# Altium schematic sheet YTN1-POWER1-RoHS.schdoc
size B; SheetNumber: 0; SheetTotal: 0
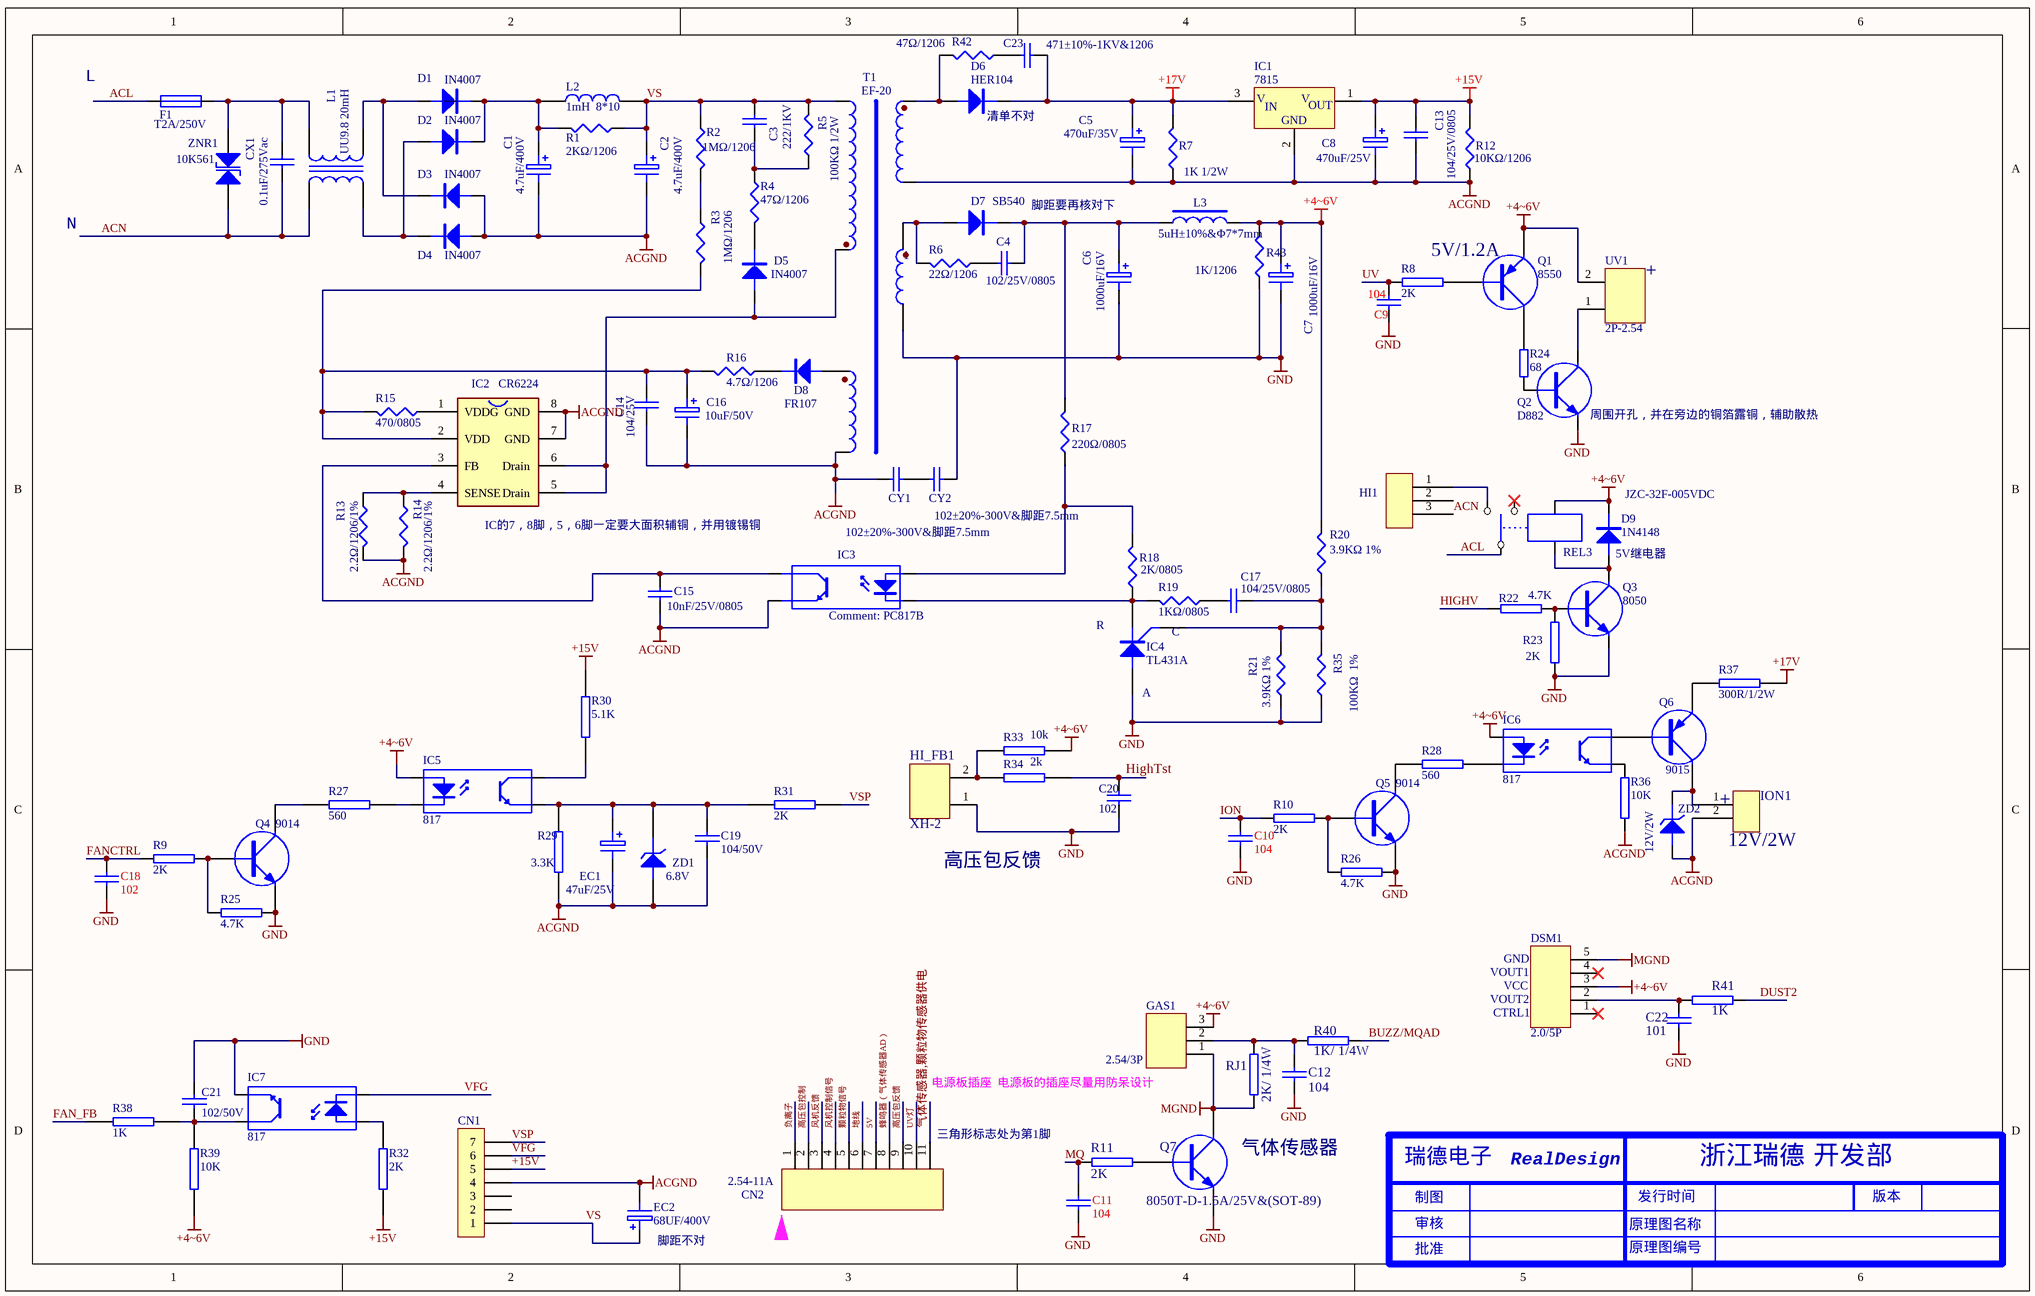
[diagram p0: YTN1-POWER1-RoHS.schdoc]

## Parts
1  (no value)
C1  4.7uF/400V
C2  4.7uF/400V
C3  222/1KV
C4  102/25V/0805
C5  470uF/35V  [ESR]
C6  1000uF/16V  [ESR]
C7  1000uF/16V  [ESR]
C8  470uF/25V  [ESR]
C9  104  [C104]
C10  104  [C104]
C11  104  [C104]
C12  104  [0805C]
C13  104/25V/0805
C14  104/25V
C15  10nF/25V/0805
C16  10uF/50V
C17  104/25V/0805
C18  102  [C104]
C19  104/50V  [0805C]
C20  102  [0805C]
C21  102/50V  [0805C]
C22  101  [0805C]
C23  471±10%-1KV&1206
CN1  (no value)  [XH-7AW]
CN2  2.54-11A  [xh-12aw]
CX1  0.1uF/275Vac
CY1  102±20%-300V&脚距7.5mm  [Y-222]
CY2  102±20%-300V&脚距7.5mm  [Y-222]
D1  IN4007
D2  IN4007
D3  IN4007
D4  IN4007
D5  IN4007
D6  HER104
D7  SB540
D8  FR107
D9  1N4148  [D10s-ai]
DSM1  2.0/5P  [xh-5aw]
EC1  47uF/25V  [47uf25v-ai]
EC2  68UF/400V  [68UF]
F1  T2A/250V
GAS1  2.54/3P  [xh-3aw]
HI1  VH  [xh-3aw]  (value not drawn)
HI_FB1  XH-2  [xh-2aw]
IC1  7815  [7805]
IC2  CR6224
IC3  PC817B
IC4  TL431A  [sip-3p]
IC5  817  [pc817]
IC6  817  [PC817]
IC7  817  [PC817]
ION1  (no value)  [xh-2a]
L1  UU9.8 20mH
L2  1mH  8*10
L3  5uH±10%&Φ7*7mm  [L6]
Q1  8550  [sot-23]
Q2  D882  [13003]
Q3  8050  [sot-23-s-1]
Q4  9014  [SOT-23-S]
Q5  9014  [SOT-23-S]
Q6  9015  [SOT-23-S]
Q7  8050T-D-1.5A/25V&(SOT-89)  [SOT-23-S]
R1  2KΩ/1206
R2  1MΩ/1206
R3  1MΩ/1206
R4  47Ω/1206
R5  100KΩ 1/2W
R6  22Ω/1206
R7  1K 1/2W
R8  2K  [R400]
R9  2K  [0805R-S]
R10  2K  [0805R-S]
R11  2K  [0805R-S]
R12  10KΩ/1206
R13  2.2Ω/1206/1%
R14  2.2Ω/1206/1%
R15  470/0805
R16  4.7Ω/1206
R17  220Ω/0805
R18  2K/0805
R19  1KΩ/0805
R20  3.9KΩ 1%
R21  3.9KΩ 1%
R22  4.7K  [0805r]
R23  2K  [0805r]
R24  68  [0805r-s]
R25  4.7K  [0805R-S]
R26  4.7K  [0805R-S]
R27  560  [0805R]
R28  560  [0805R]
R29  3.3K  [0805R]
R30  5.1K  [0805R]
R31  2K  [0805R]
R32  2K  [0805R]
R33  10k  [0805R]
R34  2k  [0805R]
R35  100KΩ  1%
R36  10K  [R400]
R37  300R/1/2W  [0805R]
R38  1K  [0805R]
R39  10K  [0805R]
R40  1K/ 1/4W  [0805R-S]
R41  1K  [0805R-S]
R42  47Ω/1206
R43  1K/1206
REL3  JZC-32F-005VDC  [HJR-3FF-S-Z]
RJ1  2K/ 1/4W  [0805R-S]
T1  EF-20
UV1  2P-2.54  [xh-2aw]
ZD1  6.8V  [zd400]
ZD2  12V/2W  [ZD400]
ZNR1  10K561  [y]

## Nets
+4~6V: C7.1 D9.K DSM1.3 GAS1.3 IC5.A IC6.A L3.2 Q1.E R20.2 R33.2 R39.1 R43.2 REL3.5 UV1.2
+15V: C8.1 C13.2 CN1.5 IC1.1(VOUT) R12.2 R30.2 R32.1
+17V: C5.1 C23.1 D6.K IC1.3(VIN) R7.2 R37.2
ACGND: C1.2 C2.2 C5.2 C8.2 C13.1 C14.2 C15.2 C16.2 C19.2 CN1.4 CY1.1 D3.A D4.A EC1.2 EC2.2 IC1.2(GND) IC2.7(GND) IC2.8(GND) IC3.E ION1.2 R7.1 R12.1 R13.2 R14.2 R29.1 R36.2 T1.5 T1.7 ZD1.A ZD2.A
GND: 1.1 C6.2 C7.2 C9.2 C10.2 C11.2 C12.2 C18.2 C20.2 C21.1 C22.2 CY2.2 HI_FB1.1 IC4.1 IC7.E Q2.E Q3.E Q4.E Q5.E Q7.E R21.1 R23.1 R25.1 R26.1 R35.1 R43.1
MGND: DSM1.5 GAS1.1 Q7.C RJ1.2
5V: CN2.7
ACL: F1.1 REL3.3
ACN: CX1.1 HI1.3 L1.1 ZNR1.2(K)
BUZZ/MQAD: R40.2
DUST2: R41.2
FAN_FB: R38.2
FANCTRL: C18.1 R9.2
HighTst: C20.1 R34.1
HIGHV: R22.2
ION: C10.1 R10.2
MQ: C11.1 R11.1
UV: C9.1 R8.2
UV灯: CN2.10
VFG: CN1.6 IC7.K
VS: C2.1 C3.2 CN1.1 EC2.1 L2.2 R1.1 R2.1 R5.2 T1.2
VSP: CN1.7 R31.1
地线: CN2.6
气体传感器,颗粒物传感器供电: CN2.11
蜂鸣器（气体传感器AD）: CN2.8
负离子: CN2.1
颗粒物信号: CN2.5
风机反馈: CN2.3
风机控制信号: CN2.4
高压包反馈: CN2.9
高压包控制: CN2.2
Net1_2: 1.2 D7.A R6.2
NetC1_1: C1.1 D1.K D2.K L2.1 R1.2
NetC3_1: C3.1 R4.1 R5.1
NetC4_1: C4.1 C6.1 D7.K L3.1 R17.2
NetC4_2: C4.2 R6.1
NetC12_1: C12.1 GAS1.2 R40.1 RJ1.1
NetC14_1: C14.1 C16.1 IC2.2(VDD) R3.2 R15.2 R16.2
NetC15_1: C15.1 IC2.3(FB) IC3.C
NetC17_1: C17.1 R19.1
NetC17_2: C17.2 IC4.3 R20.1 R21.2 R35.2
NetC19_1: C19.1 EC1.1 IC5.E R29.2 R31.2 ZD1.K
NetC21_2: C21.2 IC7.C R38.1 R39.2
NetC22_1: C22.1 DSM1.2 R41.1
NetC23_2: C23.2 R42.1
NetCX1_2: CX1.2 F1.2 L1.2 ZNR1.1(A)
NetCY1_2: CY1.2 CY2.1
NetD1_A: D1.A D3.K L1.4
NetD2_A: D2.A D4.K L1.3
NetD5_A: D5.A IC2.5(Drain) IC2.6(Drain) T1.3
NetD5_K: D5.K R4.2
NetD6_A: D6.A R42.2 T1.6
NetD8_A: D8.A T1.4
NetD8_K: D8.K R16.1
NetD9_A: D9.A Q3.C REL3.2
NetHI1_1: HI1.1 REL3.4
NetHI_FB1_2: HI_FB1.2 R33.1 R34.2
NetIC2_1: IC2.1(VDDG) R15.1
NetIC2_4: IC2.4(SENSE) R13.1 R14.1
NetIC3_A: IC3.A R17.1 R18.2
NetIC3_K: IC3.K IC4.2 R18.1 R19.2
NetIC5_C: IC5.C R30.1
NetIC5_K: IC5.K R27.1
NetIC6_C: IC6.C Q6.B
NetIC6_E: IC6.E R36.1
NetIC6_K: IC6.K R28.1
NetIC7_A: IC7.A R32.2
NetION1_1: ION1.1 Q6.C ZD2.K
NetQ1_B: Q1.B R8.1
NetQ1_C: Q1.C R24.1
NetQ2_B: Q2.B R24.2
NetQ2_C: Q2.C UV1.1
NetQ3_B: Q3.B R22.1 R23.2
NetQ4_B: Q4.B R9.1 R25.2
NetQ4_C: Q4.C R27.2
NetQ5_B: Q5.B R10.1 R26.2
NetQ5_C: Q5.C R28.2
NetQ6_E: Q6.E R37.1
NetQ7_B: Q7.B R11.2
NetR2_2: R2.2 R3.1

Not connected (* = marked no-connect by the designer): CN1 2 3; DSM1 1* 4*; HI1 2; REL3 1*

## Notes on the sheet
- L
- (near D6) 清单不对
- N
- 脚距要再核对下
- (near Q1) 5V/1.2A
- (near UV1) +
- (near Q2) 周围开孔，并在旁边的铜箔露铜，辅助散热
- (near IC2) IC的7，8脚，5，6脚一定要大面积辅铜，并用镀锡铜
- (near D9) 5V继电器
- R
- (near IC4) C
- (near IC4) A
- (near ION1) +
- (near HI_FB1) 高压包反馈
- (near ION1) 12V/2W
- (near DSM1) VOUT1
- (near DSM1) GND
- (near DSM1) VOUT2
- (near DSM1) CTRL1
- (near DSM1) VCC
- 电源板插座  电源板的插座尽量用防呆设计
- (near CN2) 三角形标志处为第1脚
- 气体传感器
- (near EC2) 脚距不对
- 瑞德电子
- RealDesign
- 浙江瑞德 开发部
- 制图
- 审核
- 原理图名称
- 发行时间
- 版本
- 批准
- 原理图编号
- (in symbol 78L05) V; IN; OUT

## Library data of the parts
1 L2 = INDUCTOR
C1 C2 = Pro18.tmp_150uF/400V_45
C3 C14 C15 C17 CX1 = Pro18.tmp_103M/50V_42
C4 C13 C23 = Pro18.tmp_104M/50V_1
C5-C8 = Pro18.tmp_1KuF/16V_17
C9-C12 C18 C22 = CAP: 瓷片电容、独石电容
C16 = Pro18.tmp_100uF/35V_31
C19 C21 CY1 CY2 = CAP: Capacitor
C20 = CAP
CN1 = CON7: Connector
CN2 = 3.96-11A
D1-D8 = Pro18.tmp_SB1660_20
D9 = DIODE
DSM1 = 3.96-5A
EC1 = ELECTRO1
EC2 = ELECTRO: 电解电容正极为"1"号脚
F1 = Pro18.tmp_1.5A/250V_52
GAS1 = 3.96-3A
HI1 = 3PIN
HI_FB1 = EH-2A
IC1 = 78L05
IC2 = CR6228
IC3 = Pro18.tmp_ET1103_16
IC4 = SCR
IC5-IC7 = OPTOISO1
ION1 = 2PIN
L1 = TRANS1
L3 = INDUCTOR2
Q1 = PNP: PNP Transistor
Q2 Q3 = NPN
Q4 Q5 Q7 = NPN: 晶体管
Q6 = PNP: 晶体管
R1-R5 R13-R15 = Pro18.tmp_10K_13
R6 R7 R12 R16-R21 R35 R42 R43 = Pro18.tmp_560R_15
R8-R11 R25 R26 R36 R40 R41 RJ1 = R: 碳膜电阻、氧化膜电阻、线绕电阻、水泥电阻、玻璃釉电阻
R22 R23 R27-R34 R37-R39 = RES2
R24 = R
REL3 = RELAY-SPDT
T1 = EE-16
UV1 = 3.96-2A
ZD1 = ZENER3: Zener Diode
ZD2 = ZD
ZNR1 = MOV